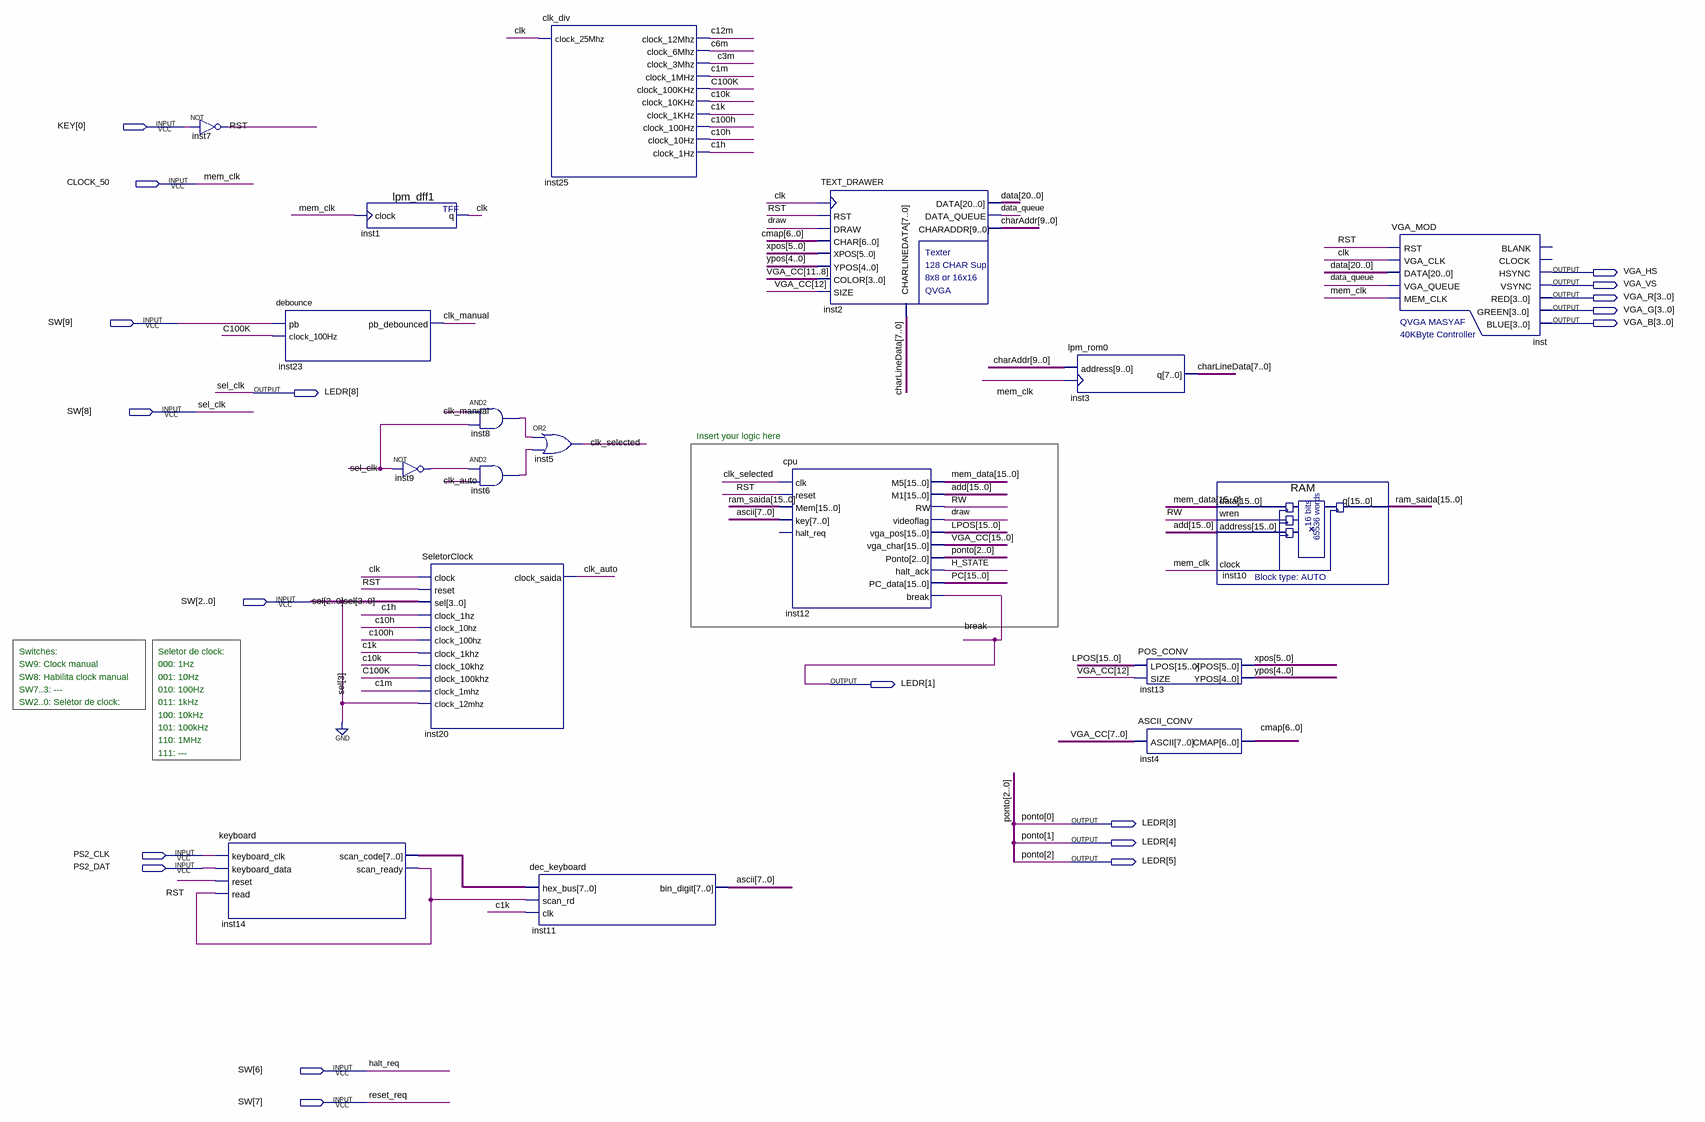
[diagram p0: schematic sheet]
// Quartus schematic AP9.bdf as structural Verilog: 18 symbols, 19 pins
module AP9 (
  input  [0:0] KEY,
  input  CLOCK_50,
  input  [9:0] SW,
  input  PS2_CLK,
  input  PS2_DAT,
  output VGA_HS,
  output VGA_VS,
  output [3:0] VGA_R,
  output [3:0] VGA_G,
  output [3:0] VGA_B,
  output [8:1] LEDR
);

  wire c1h, c1k, c1m, c3m, c6m, c10h, c10k, c12m, c100h, C100K, clk, clk_auto, clk_manual, clk_selected,
       data_queue, draw, H_STATE, inst6_out, inst8_out, inst9_out, inst14_scan_ready, RST, RW;
  wire [4:0] ypos;
  wire [5:0] xpos;
  wire [6:0] cmap;
  wire [7:0] ascii, charLineData, inst14_scan_code;
  wire [9:0] charAddr;
  wire [15:0] add, LPOS, mem_data, PC, ram_saida, VGA_CC;
  wire [20:0] data;

  not inst7 (RST, KEY[0]);
  keyboard inst14 (
    .keyboard_clk(PS2_CLK), .keyboard_data(PS2_DAT), .reset(RST), .read(inst14_scan_ready),
    .scan_code(inst14_scan_code), .scan_ready(inst14_scan_ready));
  debounce inst23 (.pb(SW[9]), .clock_100Hz(C100K), .pb_debounced(clk_manual));
  lpm_dff1 inst1 (.clock(CLOCK_50), .q(clk));
  not inst9 (inst9_out, SW[8]);
  SeletorClock inst20 (
    .clock(clk), .reset(RST), .sel({1'b0, SW[2:0]}), .clock_1hz(c1h), .clock_10hz(c10h), .clock_100hz(c100h),
    .clock_1khz(c1k), .clock_10khz(c10k), .clock_100khz(C100K), .clock_1mhz(c1m), .clock_12mhz(1'b0),
    .clock_saida(clk_auto));
  and inst8 (inst8_out, clk_manual, SW[8]);
  and inst6 (inst6_out, inst9_out, clk_auto);
  clk_div inst25 (
    .clock_25Mhz(clk), .clock_12Mhz(c12m), .clock_6Mhz(c6m), .clock_3Mhz(c3m), .clock_1MHz(c1m),
    .clock_100KHz(C100K), .clock_10KHz(c10k), .clock_1KHz(c1k), .clock_100Hz(c100h), .clock_10Hz(c10h),
    .clock_1Hz(c1h));
  or inst5 (clk_selected, inst8_out, inst6_out);
  dec_keyboard inst11 (.hex_bus(inst14_scan_code), .scan_rd(inst14_scan_ready), .clk(c1k), .bin_digit(ascii));
  cpu inst12 (
    .clk(clk_selected), .reset(RST), .Mem(ram_saida), .key(ascii), .M5(mem_data), .M1(add), .RW(RW),
    .videoflag(draw), .vga_pos(LPOS), .vga_char(VGA_CC), .Ponto(LEDR[5:3]), .halt_ack(H_STATE), .PC_data(PC),
    .\break (LEDR[1]));  // open: halt_req
  TEXT_DRAWER inst2 (
    .RST(RST), .DRAW(draw), .XPOS(xpos), .YPOS(ypos), .COLOR(VGA_CC[11:8]), .SIZE(VGA_CC[12]),
    .CHARLINEDATA(charLineData), .CLK(clk), .CHAR(cmap), .DATA(data), .DATA_QUEUE(data_queue),
    .CHARADDR(charAddr));
  lpm_rom0 inst3 (.clock(CLOCK_50), .address(charAddr), .q(charLineData));
  POS_CONV inst13 (.LPOS(LPOS), .SIZE(VGA_CC[12]), .XPOS(xpos), .YPOS(ypos));
  ASCII_CONV inst4 (.ASCII(VGA_CC[7:0]), .CMAP(cmap));
  RAM inst10 (.data(mem_data), .wren(RW), .address(add), .clock(CLOCK_50), .q(ram_saida));
  VGA_MOD inst (
    .RST(RST), .VGA_CLK(clk), .DATA(data), .VGA_QUEUE(data_queue), .MEM_CLK(CLOCK_50), .HSYNC(VGA_HS),
    .VSYNC(VGA_VS), .RED(VGA_R), .GREEN(VGA_G), .BLUE(VGA_B));  // open: BLANK, CLOCK

  assign LEDR[8] = SW[8];

  // Other names for the same wires on the sheet: break = LEDR[1]; halt_req = SW[6]; mem_clk = CLOCK_50;
  //   ponto[2:0] = LEDR[5:3]; reset_req = SW[7]; sel[2:0] = SW[2:0]; sel_clk = SW[8]

  // Notes on the sheet:
  //   Insert your logic here
  //   Switches:
  //   Seletor de clock:
  //   SW9: Clock manual
  //   000: 1Hz
  //   SW8: Habilita clock manual
  //   001: 10Hz
  //   SW7..3: ---
  //   010: 100Hz
  //   SW2..0: Seletor de clock:
  //   011: 1kHz
  //   100: 10kHz
  //   101: 100kHz
  //   110: 1MHz
  //   111: ---
endmodule
